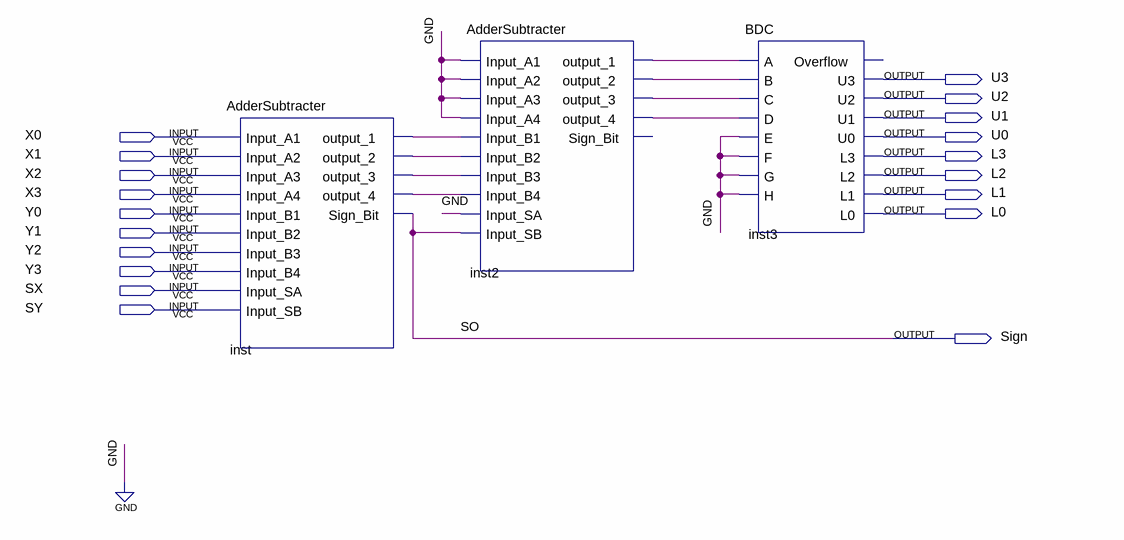
[diagram p0: schematic sheet]
// Quartus schematic AdderCalc.bdf as structural Verilog: 3 symbols, 19 pins
module AdderCalc (
  input  X0,
  input  X1,
  input  X2,
  input  X3,
  input  Y0,
  input  Y1,
  input  Y2,
  input  Y3,
  input  SX,
  input  SY,
  output U3,
  output U2,
  output U1,
  output U0,
  output L3,
  output L2,
  output L1,
  output L0,
  output Sign
);

  wire inst2_output_1, inst2_output_2, inst2_output_3, inst2_output_4, inst_output_1, inst_output_2,
       inst_output_3, inst_output_4;

  AdderSubtracter inst (
    .Input_A1(X0), .Input_A2(X1), .Input_A3(X2), .Input_A4(X3), .Input_B1(Y0), .Input_B2(Y1), .Input_B3(Y2),
    .Input_B4(Y3), .Input_SA(SX), .Input_SB(SY), .output_1(inst_output_1), .output_2(inst_output_2),
    .output_3(inst_output_3), .output_4(inst_output_4), .Sign_Bit(Sign));
  AdderSubtracter inst2 (
    .Input_A1(1'b0), .Input_A2(1'b0), .Input_A3(1'b0), .Input_A4(1'b0), .Input_B1(inst_output_1),
    .Input_B2(inst_output_2), .Input_B3(inst_output_3), .Input_B4(inst_output_4), .Input_SA(1'b0),
    .Input_SB(Sign), .output_1(inst2_output_1), .output_2(inst2_output_2), .output_3(inst2_output_3),
    .output_4(inst2_output_4));  // open: Sign_Bit
  BDC inst3 (
    .A(inst2_output_1), .B(inst2_output_2), .C(inst2_output_3), .D(inst2_output_4), .E(1'b0), .F(1'b0),
    .G(1'b0), .H(1'b0), .U3(U3), .U2(U2), .U1(U1), .U0(U0), .L3(L3), .L2(L2), .L1(L1), .L0(L0));  // open: Overflow

  // Other names for the same wires on the sheet: SO = Sign
endmodule
